# EAGLE design TSF (EAGLE 6.6.0)

## Sheet 1 of 2
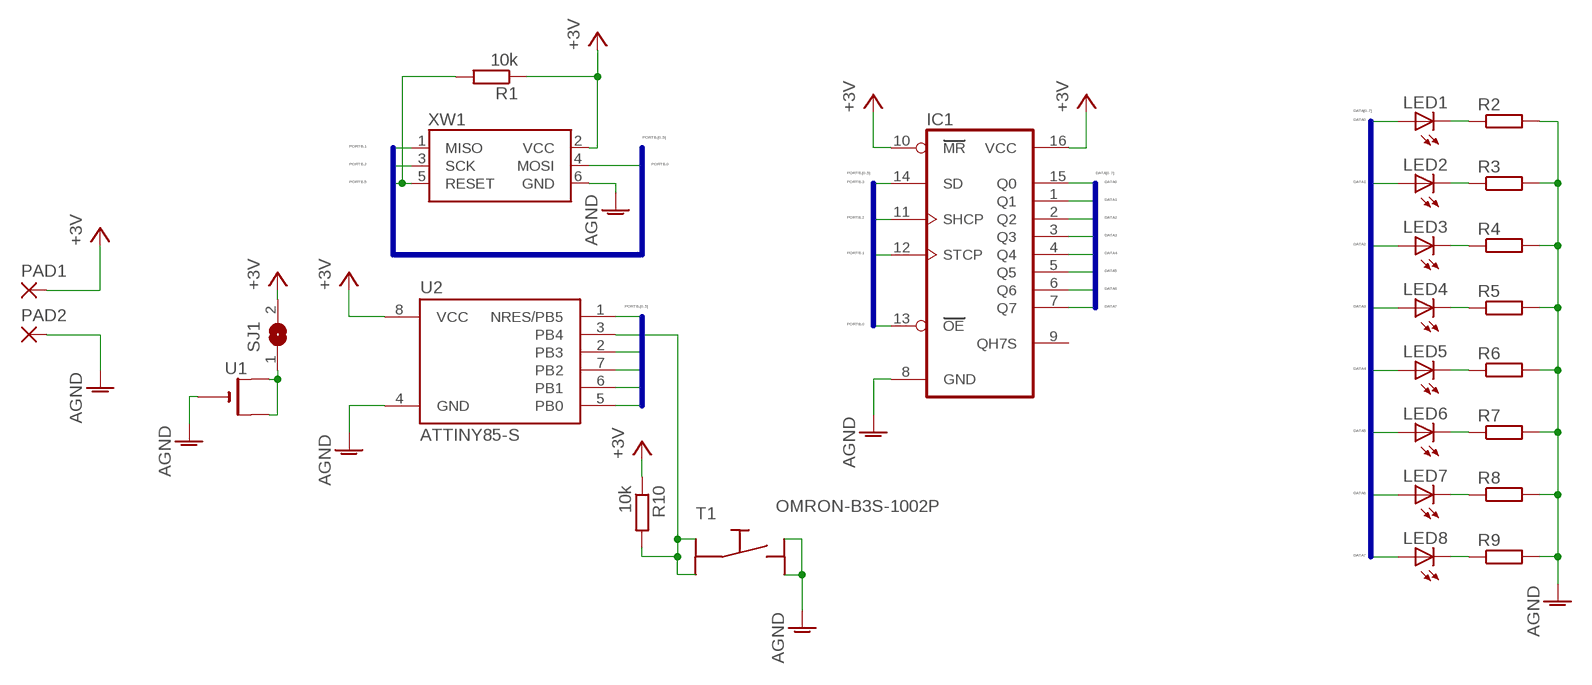
[diagram p0: schematic, sheet 1]

### Parts
IC1  74HC595D  [SO16]
LED1  LEDP-LCC-2  [P-LCC-2]
LED2  LEDP-LCC-2  [P-LCC-2]
LED3  LEDP-LCC-2  [P-LCC-2]
LED4  LEDP-LCC-2  [P-LCC-2]
LED5  LEDP-LCC-2  [P-LCC-2]
LED6  LEDP-LCC-2  [P-LCC-2]
LED7  LEDP-LCC-2  [P-LCC-2]
LED8  LEDP-LCC-2  [P-LCC-2]
PAD1  SMD2  [SMD1,27-2,54]
PAD2  SMD2  [SMD1,27-2,54]
R1  10k  R-EU_R1206  [R1206]
R2  R-EU_M1206  [M1206]
R3  R-EU_M1206  [M1206]
R4  R-EU_M1206  [M1206]
R5  R-EU_M1206  [M1206]
R6  R-EU_M1206  [M1206]
R7  R-EU_M1206  [M1206]
R8  R-EU_M1206  [M1206]
R9  R-EU_M1206  [M1206]
R10  10k  R-EU_R1206  [R1206]
SJ1  SJW  [SJW]
T1  OMRON-B3S-1002P  [B3S-1002P]
U1  CR2032SMT  [CR2032-SMD]
U2  ATTINY85-S  [SOIC8_EIAJ_208MIL]
XW1  WSLSMD  [WSL_SMD]

### Nets
AGND: IC1.8(GND) PAD2.1(P) R2.2 R3.2 R4.2 R5.2 R6.2 R7.2 R8.2 R9.2 T1.3 T1.4 U1.- XW1.6(GND)
DATA0: IC1.15(Q0) LED1.A
DATA1: IC1.1(Q1) LED2.A
DATA2: IC1.2(Q2) LED3.A
DATA3: IC1.3(Q3) LED4.A
DATA4: IC1.4(Q4) LED5.A
DATA5: IC1.5(Q5) LED6.A
DATA6: IC1.6(Q6) LED7.A
DATA7: IC1.7(Q7) LED8.A
N$1: SJ1.1 U1.+$1(+) U1.+$2(+1)
N$6: LED1.C R2.1
N$7: LED2.C R3.1
N$8: LED3.C R4.1
N$9: LED4.C R5.1
N$10: LED5.C R6.1
N$11: LED6.C R7.1
N$12: LED7.C R8.1
N$13: LED8.C R9.1
PORTB.0: IC1.13(OE) U2.5(PB0) XW1.4(MOSI)
PORTB.1: IC1.12(STCP) U2.6(PB1) XW1.1(MISO)
PORTB.2: IC1.11(SHCP) U2.7(PB2) XW1.3(SCK)
PORTB.3: IC1.14(SD) U2.2(PB3)
PORTB.4: R10.2 T1.1 T1.2 U2.3(PB4)
PORTB.5: R1.2 U2.1(NRES/PB5) XW1.5(RESET)
VCC: IC1.10(MR) IC1.16(VCC) PAD1.1(P) R1.1 R10.1 SJ1.2 XW1.2(VCC) ; supply symbol labelled +3V
Unconnected: IC1.9(QH7S)

### Buses
PORTB.[0..5]
DATA[0..7]

## Sheet 2 of 2

## Power pins joined to a net without a drawn wire
AGND: U2.4(GND)
VCC: U2.8(VCC)

## Library data of the parts
IC1 = 74_er Reihe (DIN Europa):74*595: Name des Bauteiles: 74HC595 Daten: Schieberegister 8 Bit , TTL (5V) Artikelnummer:#045077 Datenblatt:
LED1-LED8 = led:LED: LED OSRAM: - CHIPLED LG R971, LG N971, LY N971, LG Q971, LY Q971, LO R971, LY R971 LH N974, LH R974 LS Q976, LO Q976, LY Q976 LO Q996 - Hyper CHIPLED LW Q18S LB Q993, LB Q99A, LB R99A - SideLED LS A670, LO A670, LY A670, LG A670, LP A670 LB A673, LV A673, LT A673, LW A673 LH A674 LY A675 LS A676, LA A676, LO A676, LY A676, LW A676 LS A679, LY A679, LG A679 - Hyper Micro SIDELED® LS Y876, LA Y876, LO Y876, LY Y876 LT Y87S - SmartLED LW L88C, LW L88S LB L89C, LB L89S, LG L890 LS L89K, LO L89K, LY L89K LS L896, LA L896, LO L896, LY L896 - TOPLED LS T670, LO T670, LY T670, LG T670, LP T670 LSG T670, LSP T670, LSY T670, LOP T670, LYG T670 LG T671, LOG T671, LSG T671 LB T673, LV T673, LT T673, LW T673 LH T674 LS T676, LA T676, LO T676, LY T676, LB T676, LH T676, LSB T676, LW T676 LB T67C, LV T67C, LT T67C, LS T67K, LO T67K, LY T67K, LW E67C LS E67B, LA E67B, LO E67B, LY E67B, LB E67C, LV E67C, LT E67C LW T67C LS T679, LY T679, LG T679 LS T770, LO T770, LY T770, LG T770, LP T770 LB T773, LV T773, LT T773, LW T773 LH T774 LS E675, LA E675, LY E675, LS T675 LS T776, LA T776, LO T776, LY T776, LB T776 LHGB T686 LT T68C, LB T68C - Hyper Mini TOPLED® LB M676 - Mini TOPLED Santana® LG M470 LS M47K, LO M47K, LY M47K Source: http://www.osram.convergy.de LUXEON: - LUMILED® LXK2-PW12-R00, LXK2-PW12-S00, LXK2-PW14-U00, LXK2-PW14-V00 LXK2-PM12-R00, LXK2-PM12-S00, LXK2-PM14-U00 LXK2-PE12-Q00, LXK2-PE12-R00, LXK2-PE12-S00, LXK2-PE14-T00, LXK2-PE14-U00 LXK2-PB12-K00, LXK2-PB12-L00, LXK2-PB12-M00, LXK2-PB14-N00, LXK2-PB14-P00, LXK2-PB14-Q00 LXK2-PR12-L00, LXK2-PR12-M00, LXK2-PR14-Q00, LXK2-PR14-R00 LXK2-PD12-Q00, LXK2-PD12-R00, LXK2-PD12-S00 LXK2-PH12-R00, LXK2-PH12-S00 LXK2-PL12-P00, LXK2-PL12-Q00, LXK2-PL12-R00 Source: www.luxeon.com KINGBRIGHT: KA-3528ASYC Source: www.kingbright.com
PAD1 PAD2 = wirepad:SMD2: SMD PAD
R1-R10 = rcl:R-EU_: RESISTOR, European symbol
SJ1 = jumper:SJ: SMD solder JUMPER
T1 = Taster - Omron B3S-1002P:OMRON: Name des Bauteiles:SMD Taster OMRON (Omron: B3S-1002P) Daten:Waschdicht, 4 Kontakte, mineatur Taster, 6 x 6 x 4,3 mm Artikelnummer:#088017 Datenblatt:www.datasheet.com
U1 = cr2032:CR2032
U2 = _hhn_attiny25_45_85:ATTINY85*: ATMEL ATtiny 85 Packages: P = PDIP 08 30mil S = SOIC 08 EIAJ 208mil Technologies Note: for complete ordering code (temp. range, finish, tape&reel etc.) see www.atmel.com • Supply Voltage: V = (1.8…5.5)V | [blank] = (2.7…5.5)V • Speed: 10 = 10 MHz | 20 = 20 MHz Author: Dipl.-Ing. FH Rainer Bayer HHN Hochschule Heilbronn (Heilbronn University), rainer.bayer@hs-heilbronn.de Ingenieurbüro ing-rb, mail@ing-rb.de
XW1 = Atmel - ISP_6   (AVR ISP MKII):WSL: Name des Bauteiles: Wannenstecker 6 pol. Daten: 6 pol. goldene Kontakte ! Artikelnummer:#131231 Datenblatt:www.datasheet.com / www.reichelt.de

## Board
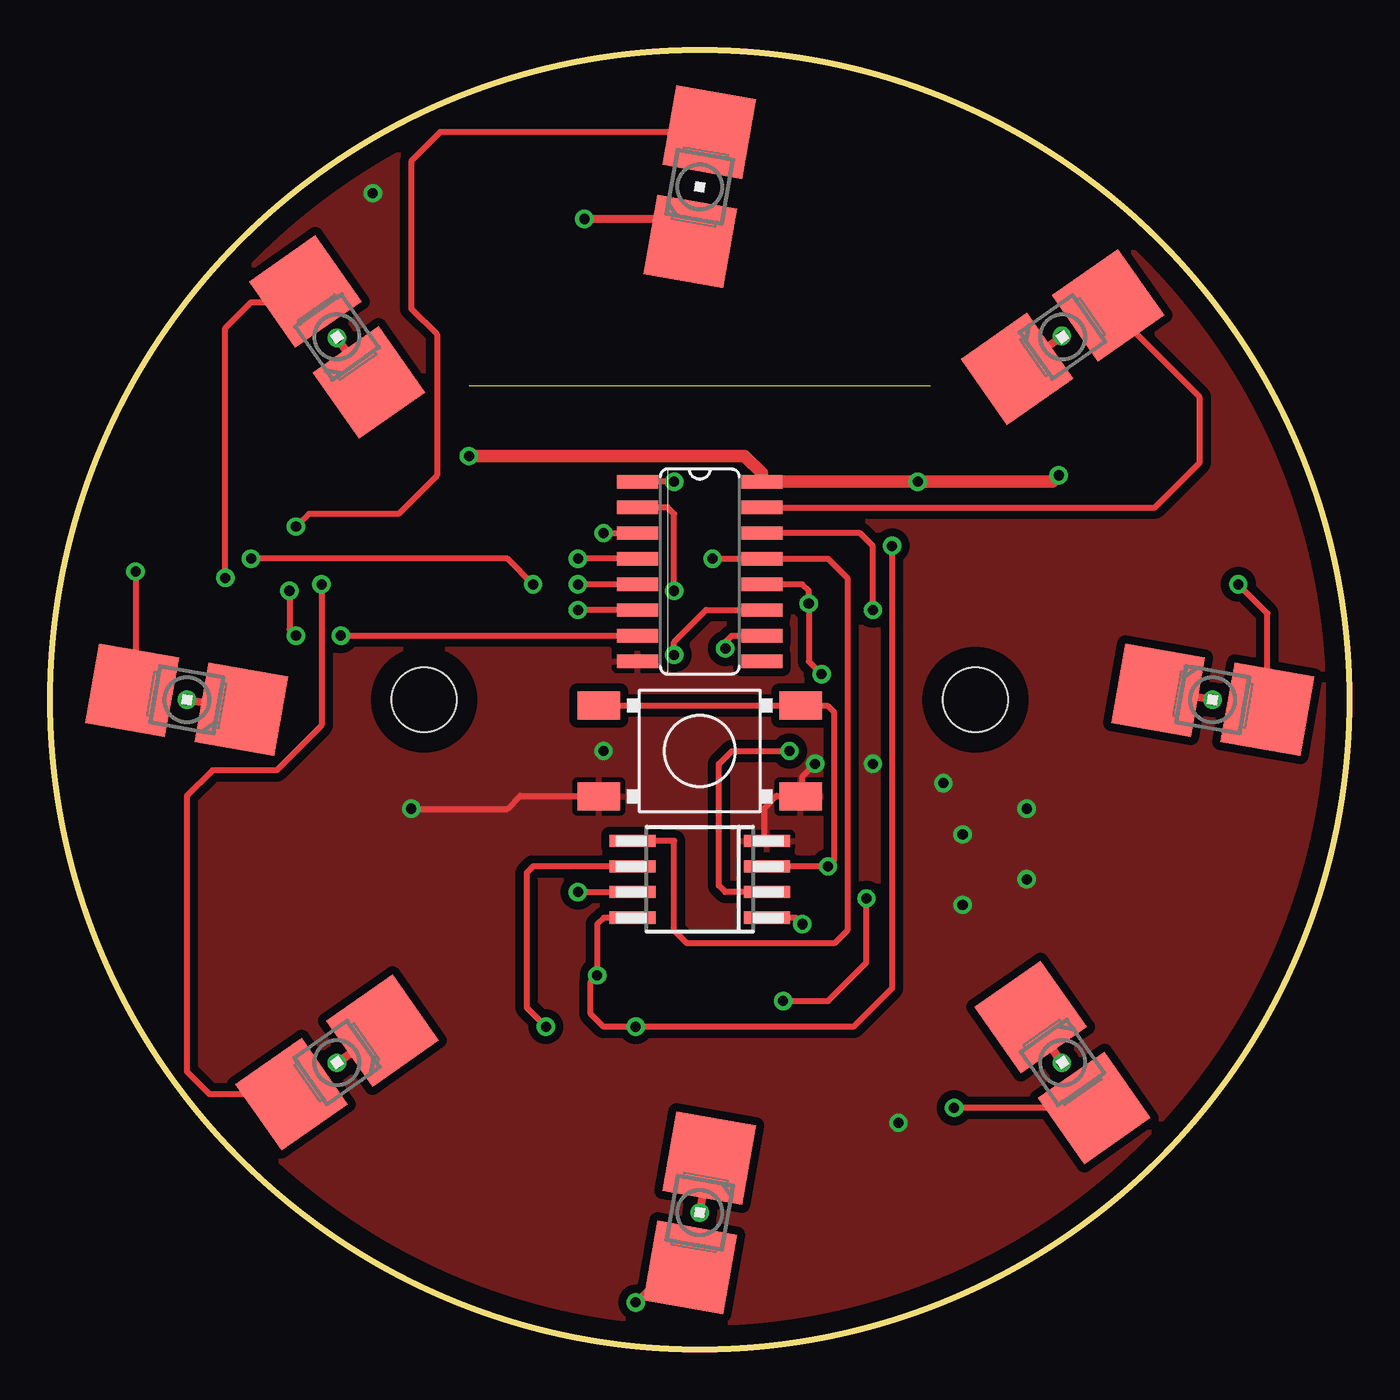
[diagram p1: board, top side]
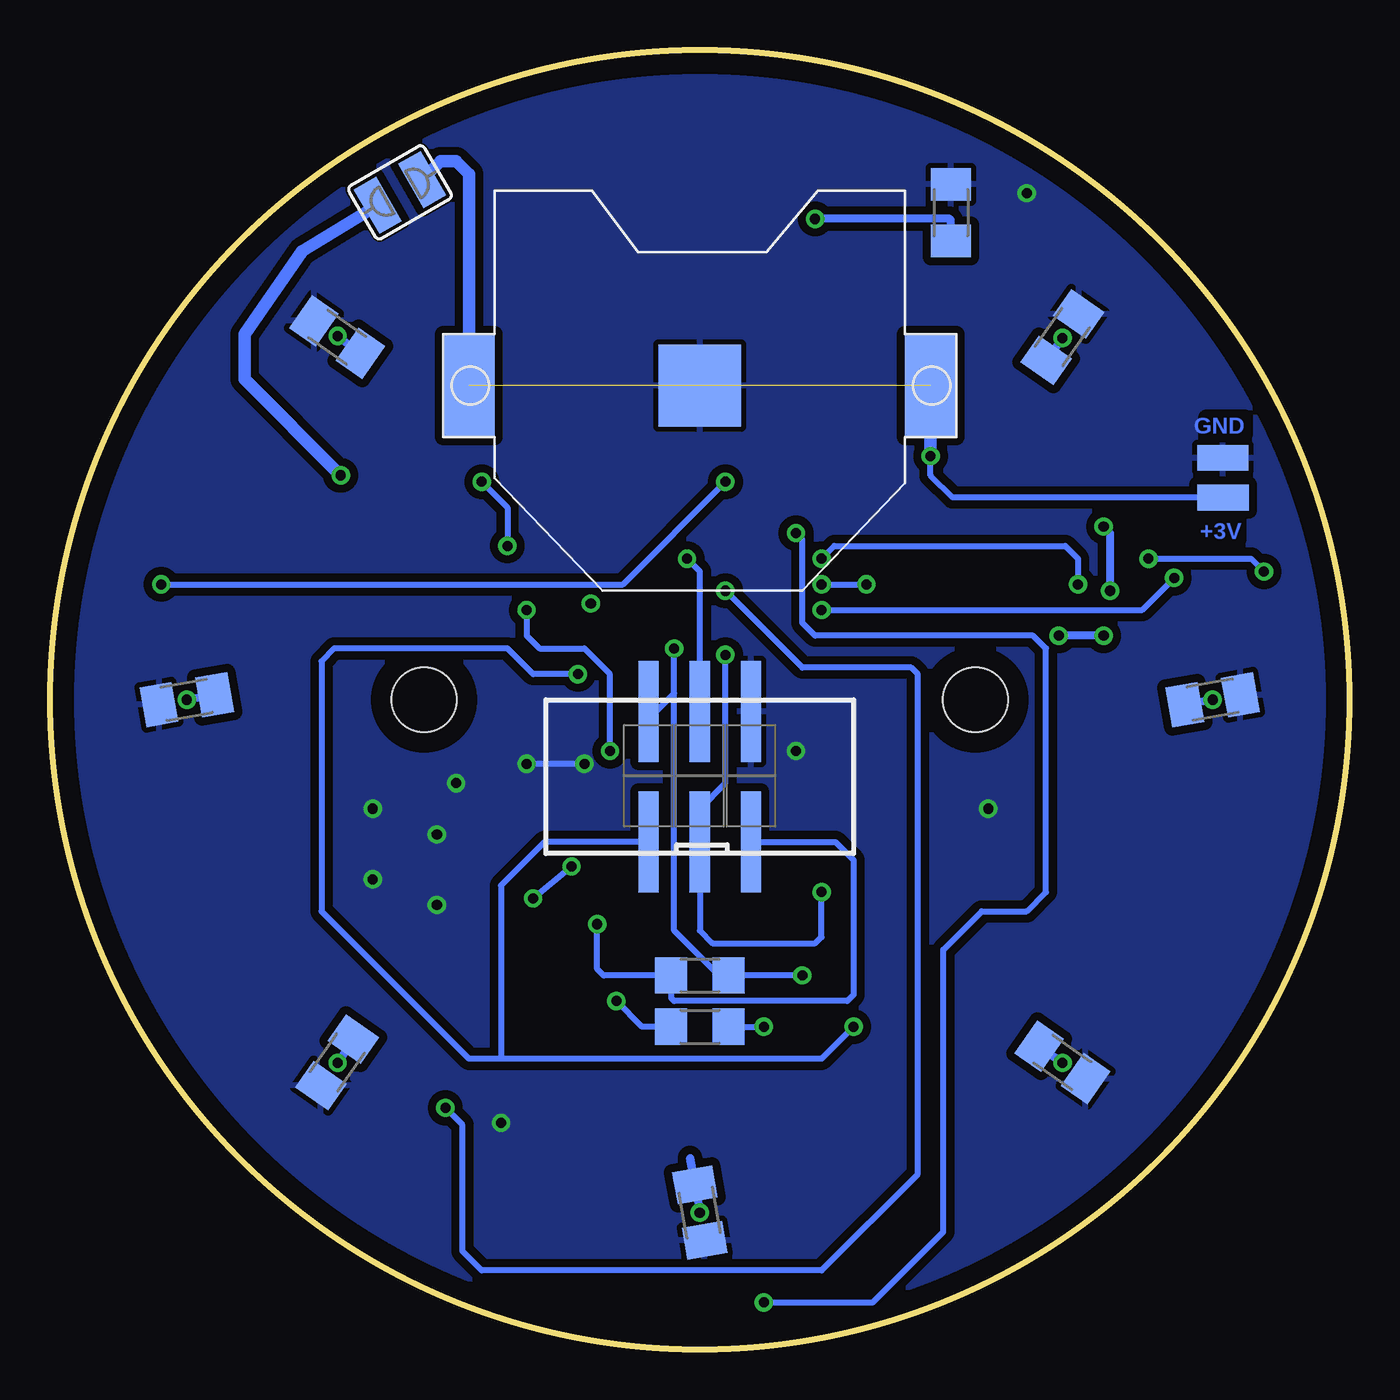
[diagram p2: board, bottom side, seen from below]

Size 64.31 x 64.31 mm. Coordinates in mm from the lower left corner, seen from the top.
Outline: circle at 32.15,32.15 radius 32.15
Copper layers (1*16): Top 0.035mm / dielectric 1.5mm / Bottom 0.035mm
Design rules "default": minimum track width 10mil, minimum drill 24mil, track to track 8mil, track to pad 8mil, pad to pad 8mil, via to via 8mil, smd to smd 8mil, copper to edge 40mil, drill to drill 8mil, minimum pad ring 10mil, minimum via ring 8mil, stop-mask expansion 4mil, vias tented up to drill 0mil, thermal gap 10mil
Holes 3.2 mm at 45.81,32.15 18.5,32.15

### Footprints (pad centres in the part's own frame; a part is rotated, then mirrored left to right if it is on the bottom)
SO16 = smd 0.66 x 2.032: 1 -4.445,-3.073; 2 -3.175,-3.073; 3 -1.905,-3.073; 4 -0.635,-3.073; 5 0.635,-3.073; 6 1.905,-3.073; 7 3.175,-3.073; 8 4.445,-3.073; 9 4.445,3.073; 10 3.175,3.073; 11 1.905,3.073; 12 0.635,3.073; 13 -0.635,3.073; 14 -1.905,3.073; 15 -3.175,3.073; 16 -4.445,3.073
P-LCC-2 = smd 4 x 4: A 0,2.75; C 0,-2.75
SMD1,27-2,54 = smd 1.27 x 2.54: 1 0,0
R1206 = smd 1.6 x 1.803: 1 -1.422,0; 2 1.422,0
M1206 = smd 1.6 x 2: 1 -1.4,0; 2 1.4,0
SJW = smd 1.27 x 2.54: 1 -1.27,0; 2 1.27,0
B3S-1002P = smd 2.1 x 1.4: 1 5,-2.25; 2 -5,-2.25; 3 5,2.25; 4 -5,2.25
CR2032-SMD = smd 2.54 x 5.08: +$1 -11.43,0; +$2 11.43,0 | smd 4.064 x 4.064: - 0,0
SOIC8_EIAJ_208MIL = smd 0.6 x 2.286: 1 -1.905,-3.33; 2 -0.635,-3.33; 3 0.635,-3.33; 4 1.905,-3.33; 5 1.905,3.33; 6 0.635,3.33; 7 -0.635,3.33; 8 -1.905,3.33
WSL_SMD = smd 1 x 5: 1 -2.54,-3.24; 2 -2.54,3.24; 3 0,-3.24; 4 0,3.24; 5 2.54,-3.24; 6 2.54,3.24

### Placement (x,y rotation side)
IC1  32.15,38.5 270 top
LED1  50.11,50.11 305 top
LED2  57.55,32.15 260 top
LED3  50.11,14.19 215 top
LED4  32.15,6.75 170 top
LED5  14.19,14.19 125 top
LED6  6.75,32.15 80 top
LED7  14.19,50.11 35 top
LED8  32.15,57.55 350 top
PAD1  6.24,42.17 270 bottom
PAD2  6.25,44.13 270 bottom
R1  32.15,18.5 180 bottom
R2  50.11,50.11 145 bottom
R3  57.55,32.15 190 bottom
R4  50.11,14.19 235 bottom
R5  32.15,6.75 280 bottom
R6  14.19,14.19 325 bottom
R7  6.75,32.15 10 bottom
R8  14.19,50.11 55 bottom
R9  19.72,56.28 90 bottom
R10  32.15,15.96 180 bottom
SJ1  47,57.28 210 bottom
T1  32.15,29.61 180 top
U1  32.15,47.71 0 bottom
U2  32.15,23.26 90 top
U$1  [25X25_BEST]  21.36,8.66 150 top
XW1  32.15,28.34 0 bottom

### Tracks (layer width: path | path; a pad name or v marks a point on that pad's centre or on a via)
AGND  (via drill 0.5)
  Top 0.305: T1.4 35.94,27.36 | 35.94,27.36 35.33,26.76 35.33,25.32 U2.4 | v17.87,26.76 22.63,26.76 23.26,27.39 27.13,27.39 T1.3 | 35.94,27.36 35.96,27.39 37.23,27.39 37.23,28.34 v37.87,28.98
  Bottom 0.305: v37.87,28.98 v40.73,28.98
  other vias: 42,11.2 15.96,57.24 27.39,29.61 48.35,26.76 45.17,25.49 44.22,28.03 48.35,23.26 45.17,21.99
  pour Top (isolate 0.406): 64.54,64.54 0.09,64.54 0.09,-0.23 64.54,-0.23
  pour Bottom (isolate 0.406): 64.54,64.54 0.09,64.54 0.09,-0.23 64.54,-0.23
DATA0
  Top 0.254: LED1.A 54.21,51.69
  Top 0.305: IC1.15 54.7,41.68 56.92,43.9 56.92,47.14 LED1.A
DATA1  (via drill 0.5)
  Top 0.305: LED2.A 60.26,36.43 v58.82,37.87 | v30.88,42.95 IC1.1
  Top 0.406: 61.05,32.46 LED2.A
  Bottom 0.305: v58.82,37.87 35.96,37.87 v30.88,42.95
DATA2  (via drill 0.5)
  Top 0.305: v30.88,37.55 30.88,41.36 30.57,41.68 IC1.2 | LED3.A v44.75,11.94
  Bottom 0.305: v30.88,37.55 27.07,33.74 21.68,33.74 21.36,33.42 21.36,8.66 26.12,3.9 42.95,3.9 43.9,4.85 43.9,11.09 v44.75,11.94
DATA3  (via drill 0.5)
  Top 0.305: LED4.A 30.72,4.05 v28.98,2.31 | v27.39,40.41 IC1.3
  Bottom 0.305: v28.98,2.31 23.58,2.31 20.09,5.8 20.09,19.77 18.18,21.68 15.96,21.68 15.01,22.63 15.01,34.69 15.64,35.33 26.44,35.33 27.07,35.96 27.07,40.09 v27.39,40.41
DATA4  (via drill 0.5)
  Top 0.305: IC1.4 v26.12,39.14 | LED5.A 7.88,12.62 6.75,13.74 6.75,27.39 8.02,28.66 11.2,28.66 13.42,30.88 v13.42,37.87
  Bottom 0.305: v26.12,39.14 25.49,39.77 14.06,39.77 13.42,39.14 v13.42,37.87
DATA5  (via drill 0.5)
  Top 0.305: IC1.5 v26.12,37.87 | v4.21,38.5 4.21,32.8 LED6.A | v23.9,37.87 22.63,39.14 v9.93,39.14
  Bottom 0.305: v26.12,37.87 v23.9,37.87 | v9.93,39.14 4.85,39.14 v4.21,38.5
DATA6  (via drill 0.5)
  Top 0.305: IC1.6 v26.12,36.6 | v8.66,38.19 8.66,50.57 9.93,51.84 12.09,51.84 LED7.A
  Bottom 0.305: v26.12,36.6 10.25,36.6 v8.66,38.19
DATA7  (via drill 0.5)
  Top 0.305: LED8.A 19.3,60.26 17.87,58.82 17.87,51.52 19.14,50.25 19.14,43.27 17.23,41.36 12.79,41.36 v12.15,40.73 | v11.83,37.55 11.83,35.65 v12.15,35.33 | v14.37,35.33 IC1.7
  Bottom 0.406: v12.15,40.73 11.83,40.41 v11.83,37.55 | v12.15,35.33 v14.37,35.33
N$1  (1 unrouted)
  Bottom 0.61: U1.+$1 43.58,58.19 44.22,58.82 44.99,58.82 SJ1.1
N$6  (via drill 0.5)
  Top 0.406: 48.66,47.39 48.66,47.73 LED1.C v50.09,50.17
  Bottom 0.406: R2.1 v50.09,50.17
N$7  (via drill 0.5)
  Top 0.406: 54.38,32.16 LED2.C v57.55,32.15
  Bottom 0.406: R3.1 v57.55,32.15
N$8  (via drill 0.5)
  Top 0.406: v50.09,14.17 LED3.C
  Top 0.813: 47.42,15.33 LED3.C
  Bottom 0.406: R4.1 v50.09,14.17
N$9  (via drill 0.5)
  Top 0.406: v32.15,6.75 LED4.C
  Top 0.813: 32.46,9.29 LED4.C
  Bottom 0.406: R5.1 LED4.C v32.15,6.75
N$10  (via drill 0.5)
  Top 0.406: v14.19,14.17 LED5.C
  Top 0.813: 16.91,16.28 16.91,16.24 LED5.C
  Bottom 0.406: R6.1 v14.19,14.17
N$11  (via drill 0.5)
  Top 0.406: 9.61,31.83 LED6.C v6.75,32.15
  Bottom 0.406: v6.75,32.15 R7.1
N$12  (via drill 0.5)
  Top 0.406: v14.19,50.07 LED7.C
  Bottom 0.406: R8.1 v14.19,50.07
N$13  (via drill 0.5)
  Top 0.406: 31.83,54.7 LED8.C 30.56,55.97 v26.44,55.97
  Bottom 0.406: R9.1 19.72,55.91 19.77,55.97 v26.44,55.97
PORTB.0  (via drill 0.5)
  Top 0.305: v32.79,39.14 IC1.13 38.5,39.14 39.46,38.19 39.46,20.72 38.82,20.09 31.52,20.09 30.88,20.72 30.88,25.17 U2.5
  Bottom 0.305: XW1.4 32.15,38.5 v32.79,39.14
PORTB.1  (via drill 0.5)
  Top 0.305: IC1.12 37.23,37.87 37.55,37.55 v37.55,36.92 37.55,34.06 v38.19,33.42 | U2.6 23.9,23.9 23.58,23.58 23.58,16.91 v24.53,15.96
  Bottom 0.305: v24.53,15.96 26.12,14.37 42,14.37 | 42,14.37 43.58,14.37 50.89,21.68 50.89,34.06 50.25,34.69 41.68,34.69 40.41,33.42 v38.19,33.42 | XW1.1 39.84,25.1 42,22.95 42,14.37
PORTB.2  (via drill 0.5)
  Top 0.305: v26.12,22.63 U2.7 | v30.88,34.38 30.88,35.01 32.47,36.6 IC1.11
  Bottom 0.305: v26.12,22.63 26.12,20.41 26.44,20.09 31.52,20.09 32.15,20.72 XW1.3 32.15,26.76 30.88,28.03 v30.88,34.38
PORTB.3  (via drill 0.5)
  Top 0.305: U2.2 33.42,22.63 33.11,22.95 33.11,28.98 33.74,29.61 v36.6,29.61 | v40.73,36.6 40.73,39.77 40.09,40.41 IC1.14
  Bottom 0.305: v36.6,29.61 36.6,33.42 37.87,34.69 40.09,34.69 40.73,35.33 v40.73,36.6
PORTB.4  (via drill 0.5)
  Top 0.305: T1.1 T1.2 37.18,31.84 38.5,31.84 38.82,31.52 38.82,24.22 v38.5,23.9 U2.3 | v36.28,17.23 38.5,17.23 40.41,19.14 v40.41,22.31
  Bottom 0.305: R10.2 35.01,15.96 v36.28,17.23 | v40.41,22.31 v38.5,23.9
PORTB.5  (via drill 0.5)
  Top 0.305: 35.33,21.2 U2.1 36.92,21.36 v37.23,21.04
  Bottom 0.305: XW1.5 25.42,25.1 24.53,24.22 24.53,17.55 24.85,17.23 33.42,17.23 33.58,17.38 R1.2 36.92,18.5 37.23,18.82 v37.23,21.04
VCC  (via drill 0.5)
  Top 0.305: v33.42,34.69 33.42,35.01 33.74,35.33 IC1.10 | v41.68,39.77 41.68,17.87 39.77,15.96 v28.98,15.96 27.39,15.96 26.76,16.6 26.76,18.18 v27.07,18.5 27.07,21.04 27.39,21.36 U2.8
  Top 0.61: v20.72,44.22 34.38,44.22 35.23,43.37 IC1.16 v42.95,42.95 49.62,42.95 v49.93,43.27
  Bottom 0.305: XW1.2 34.31,31.58 33.42,32.47 | 33.42,32.47 v33.42,34.69 | 33.42,32.47 33.42,20.72 31.2,18.5 R1.1 v27.07,18.5 | v42.95,42.95 41.68,41.68 v41.68,39.77 | R10.1 v28.98,15.96 | PAD1.1 19.62,42.17 20.72,43.27 v20.72,44.22
  Bottom 0.61: v20.72,44.22 20.72,45.49 | SJ1.2 51.84,54.38 54.7,50.25 54.7,48.03 v49.93,43.27

### Text on the board
Bottom: GND | +3V
Bestueckungsdruck: Modus